# Altium schematic sheet Drive_Y.SchDoc
size A4; Organization: Altium Limited; Address1: L3, 12a Rodborough Rd; Address2: Frenchs Forest; Address3: NSW; Address4: Australia 2086
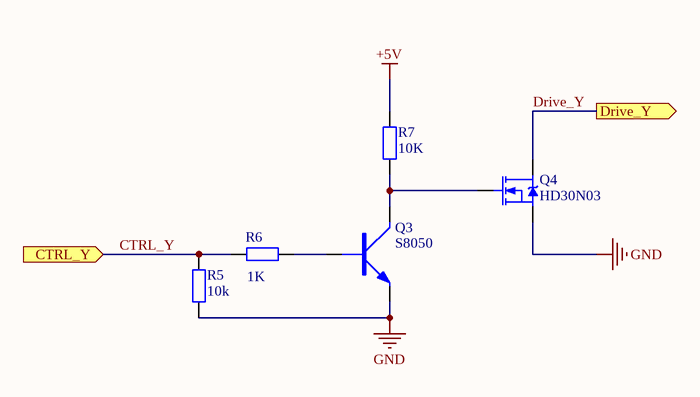
[diagram p0: Drive_Y.SchDoc]

## Parts
Q3  S8050  [SOT-23]
Q4  HD30N03  [TO252]
R5  10k  [R 0603]
R6  1K  [R 0603]
R7  10K  [R 0603]

## Ports
CTRL_Y (in), Drive_Y (out)

## Nets
+5V: R7.2
GND: Q3.E Q4.S R5.1
CTRL_Y: R5.2 R6.1 ; port CTRL_Y
Drive_Y: Q4.D ; port Drive_Y
NetQ3_B: Q3.B R6.2
NetQ3_C: Q3.C Q4.G R7.1

## Notes on the sheet
- Title
- Size:
- Date:
- A4
- Number:
- Time:
- Revision:
- Sheet
- of
- File:

## Library data of the parts
Q3 = NPN: NPN三极管
Q4 = N-MOS: N沟道场效应管
R5-R7 = R: 贴片电阻; 版权归属: 源创客; BOM名称: 贴片电阻; 学习资源: www.ooocke.com